# Altium schematic sheet imu.SchDoc
size A
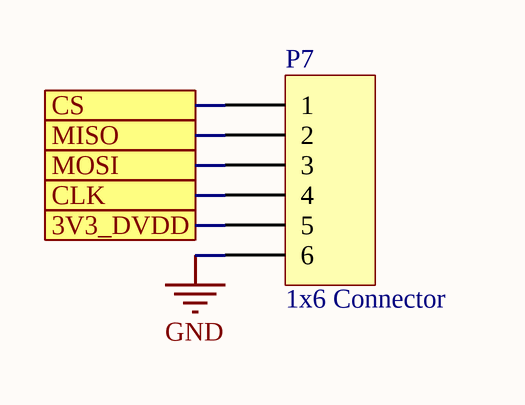
[diagram p0: imu.SchDoc]

## Parts
P7  1x6 Connector  [Molex KK 6x1]

## Ports
3V3_DVDD, CLK, CS, MISO, MOSI

## Nets
GND: P7.6
3V3_DVDD: P7.5 ; port 3V3_DVDD
CLK: P7.4 ; port CLK
CS: P7.1 ; port CS
MISO: P7.2 ; port MISO
MOSI: P7.3 ; port MOSI

## Library data of the parts
P7 = Molex KK 1x6: 1x6 Molex KK Connector